# EAGLE design 7segement4digits1badidea-many-digits-mk-2.1 (EAGLE 6.5.0)
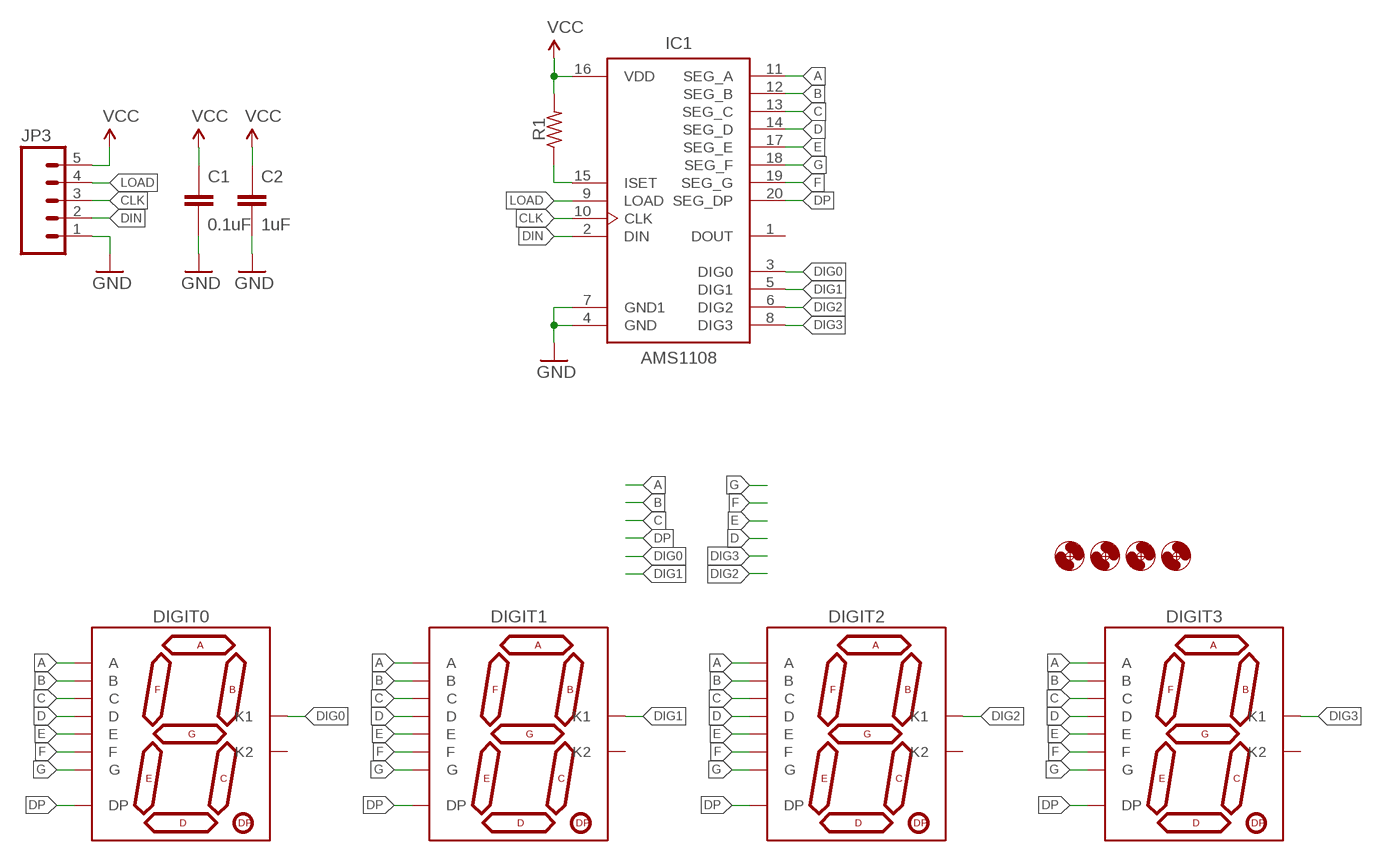
[diagram p0: schematic, sheet 1]

## Parts
C1  0.1uF  CAPACITOR-CERAMICC0603  [C0603]
C2  1uF  CAPACITOR-CERAMICC0805  [C0805]
DIGIT0  7SEG_1DIGPTH-25.4MM  [7SEG_1DIG_25.4MM]
DIGIT1  7SEG_1DIGPTH-25.4MM  [7SEG_1DIG_25.4MM]
DIGIT2  7SEG_1DIGPTH-25.4MM  [7SEG_1DIG_25.4MM]
DIGIT3  7SEG_1DIGPTH-25.4MM  [7SEG_1DIG_25.4MM]
H1  HOLE#2  [HOLE-#2]
H2  HOLE#2  [HOLE-#2]
H3  HOLE#2  [HOLE-#2]
H4  HOLE#2  [HOLE-#2]
IC1  AMS1108  AMS1108SOIC-20W  [SO20W-NOSUCK]
JP3  M05PTH  [1X05]
R1  RESISTORR0603  [R0603]

## Nets
A: DIGIT0.7(A) DIGIT1.7(A) DIGIT2.7(A) DIGIT3.7(A) IC1.11(SEG_A)
B: DIGIT0.6(B) DIGIT1.6(B) DIGIT2.6(B) DIGIT3.6(B) IC1.12(SEG_B)
C: DIGIT0.4(C) DIGIT1.4(C) DIGIT2.4(C) DIGIT3.4(C) IC1.13(SEG_C)
CLK: IC1.10(CLK) JP3.3
D: DIGIT0.2(D) DIGIT1.2(D) DIGIT2.2(D) DIGIT3.2(D) IC1.14(SEG_D)
DIG0: DIGIT0.3(K1) IC1.3(DIG0)
DIG1: DIGIT1.3(K1) IC1.5(DIG1)
DIG2: DIGIT2.3(K1) IC1.6(DIG2)
DIG3: DIGIT3.3(K1) IC1.8(DIG3)
DIN: IC1.2(DIN) JP3.2
DP: DIGIT0.5(DP) DIGIT1.5(DP) DIGIT2.5(DP) DIGIT3.5(DP) IC1.20(SEG_DP)
E: DIGIT0.1(E) DIGIT1.1(E) DIGIT2.1(E) DIGIT3.1(E) IC1.17(SEG_E)
F: DIGIT0.9(F) DIGIT1.9(F) DIGIT2.9(F) DIGIT3.9(F) IC1.19(SEG_G)
G: DIGIT0.10(G) DIGIT1.10(G) DIGIT2.10(G) DIGIT3.10(G) IC1.18(SEG_F)
GND: C1.2 C2.2 IC1.4(GND) IC1.7(GND1) JP3.1
LOAD: IC1.9(LOAD) JP3.4
N$1: IC1.15(ISET) R1.1
VCC: C1.1 C2.1 IC1.16(VDD) JP3.5 R1.2
Unconnected: DIGIT0.8(K2) DIGIT1.8(K2) DIGIT2.8(K2) DIGIT3.8(K2) IC1.1(DOUT)

## Library data of the parts
C1 C2 = A_butts:CAPACITOR-CERAMIC: CAPACITOR, European symbol
DIGIT0 DIGIT1-DIGIT3 = A_butts:7SEG_1DIG
H1-H4 = A_butts:HOLE: MOUNTING HOLE with drill center marker
IC1 = A_butts:AMS1108
JP3 = A_butts:M05: Header 5 Standard 5-pin 0.1" header. Use with straight break away headers (SKU : PRT-00116), right angle break away headers (PRT-00553), swiss pins (PRT-00743), machine pins (PRT-00117), and female headers (PRT-00115). Molex polarized connector foot print use with SKU : PRT-08230 with associated crimp pins and housings.
R1 = A_butts:RESISTOR: RESISTOR, American symbol

## Board
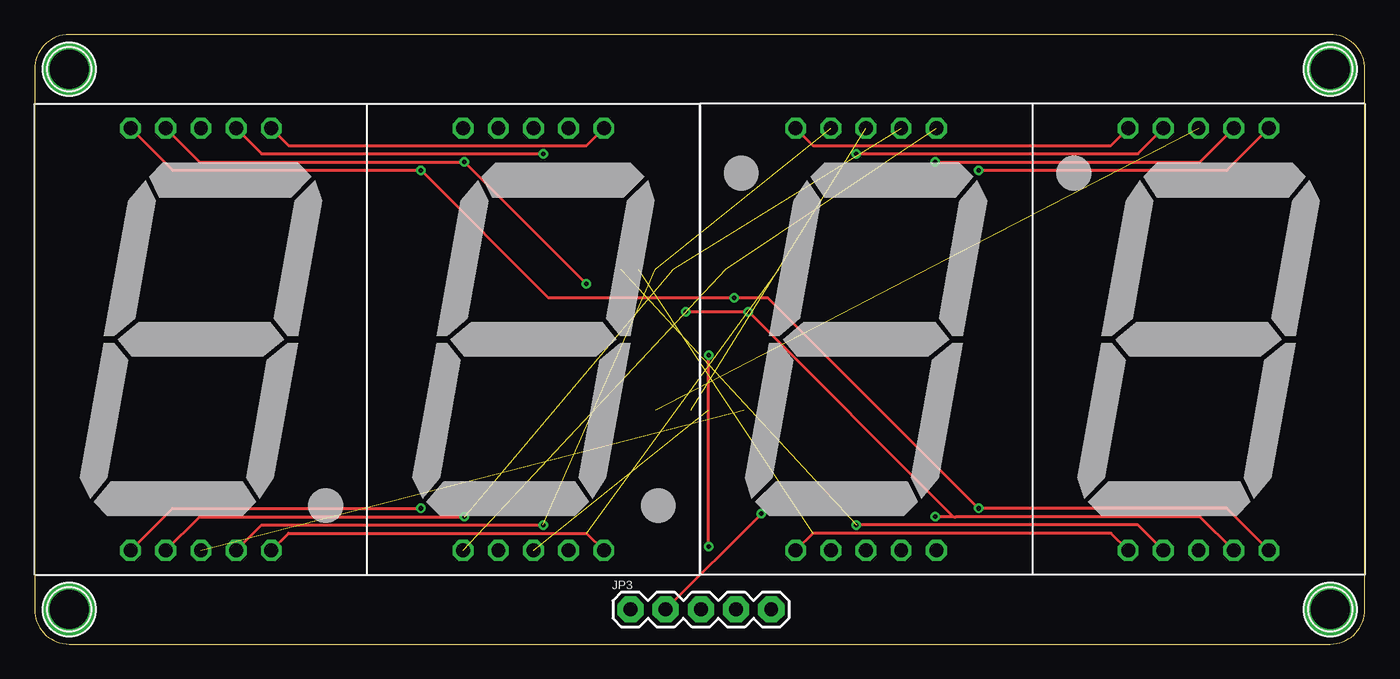
[diagram p1: board, top side]
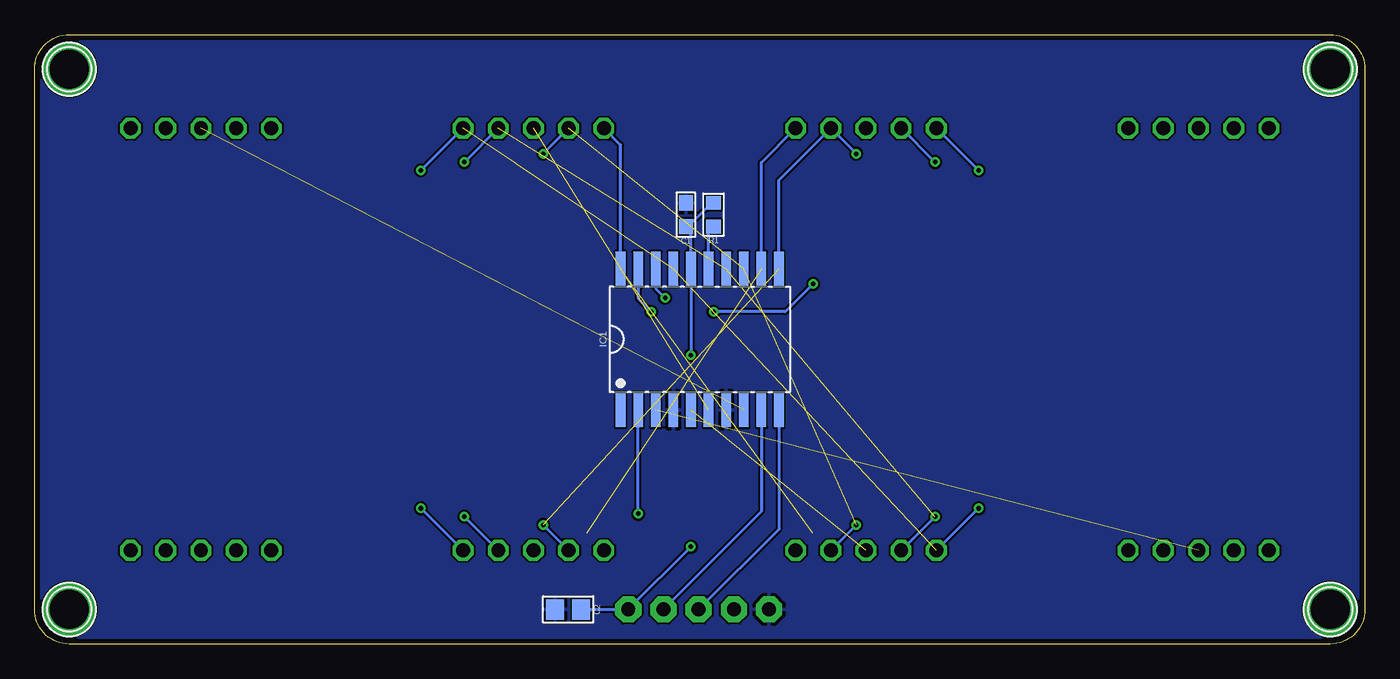
[diagram p2: board, bottom side, seen from below]

Size 96 x 44 mm. Coordinates in mm from the lower left corner, seen from the top.
Outline: 2.5,0 93.5,0 arc90 96,2.5 96,41.5 arc90 93.5,44 2.5,44 arc90 0,41.5 0,2.5 arc90 2.5,0
Copper layers (1*16): Top 0.0356mm / dielectric 1.5011mm / Bottom 0.0356mm
Design rules "LaenPCBOrder_2": minimum track width 6mil, minimum drill 13mil, track to track 6mil, track to pad 6mil, pad to pad 6mil, via to via 6mil, smd to smd 6mil, copper to edge 15mil, drill to drill 6mil, minimum pad ring 7mil, minimum via ring 7mil, stop-mask expansion 3mil, vias tented up to drill 20mil, thermal gap 10mil

### Footprints (pad centres in the part's own frame; a part is rotated, then mirrored left to right if it is on the bottom)
C0603 = smd 1.1 x 1: 1 -0.85,0; 2 0.85,0
C0805 = smd 1.3 x 1.5: 1 -0.95,0; 2 0.95,0
7SEG_1DIG_25.4MM = drill 1 pad 1.5 octagon: 1 -5.08,-15.24; 2 -2.54,-15.24; 3 0,-15.24; 4 2.54,-15.24; 5 5.08,-15.24; 6 5.08,15.24; 7 2.54,15.24; 8 0,15.24; 9 -2.54,15.24; 10 -5.08,15.24
HOLE-#2 = drill 2.8 pad 3.81: P$1 0,0
SO20W-NOSUCK = smd 0.7 x 2.5: 1 -5.715,-5.08; 2 -4.445,-5.08; 3 -3.175,-5.08; 4 -1.905,-5.08; 5 -0.635,-5.08; 6 0.635,-5.08; 7 1.905,-5.08; 8 3.175,-5.08; 9 4.445,-5.08; 10 5.715,-5.08; 11 5.715,5.08; 12 4.445,5.08; 13 3.175,5.08; 14 1.905,5.08; 15 0.635,5.08; 16 -0.635,5.08; 17 -1.905,5.08; 18 -3.175,5.08; 19 -4.445,5.08; 20 -5.715,5.08
1X05 = drill 1 pad 1.88 octagon: 1 0,0; 2 2.54,0; 3 5.08,0; 4 7.62,0; 5 10.16,0
R0603 = smd 1 x 1.1: 1 -0.85,0; 2 0.85,0

### Placement (x,y rotation side)
C1  49,31 90 bottom
C2  57.5,2.5 180 bottom
DIGIT0  12,22 0 top
DIGIT1  36,22 0 top
DIGIT2  60,22 180 top
DIGIT3  84,22 180 top
H1  2.5,2.5 0 top
H2  2.5,41.5 0 top
H3  93.5,41.5 0 top
H4  93.5,2.5 0 top
IC1  48,22 0 bottom
JP3  43,2.5 0 top
R1  47,31 90 bottom

### Tracks (layer width: path | path; a pad name or v marks a point on that pad's centre or on a via)
A  (via drill 0.33)  (1 unrouted)
  Top 0.2: DIGIT0.7 16.38,35.4 v36.7,35.4 | DIGIT3.7 79.62,8.6 v59.3,8.6
  Bottom 0.2: v36.7,35.4 DIGIT1.7 42.28,33.49 IC1.11 | v59.3,8.6 DIGIT2.7
B  (1 unrouted)
  Top 0.2: DIGIT0.6 18.32,36 39.84,36 DIGIT1.6 | DIGIT3.6 77.68,8 56.16,8 DIGIT2.6
  Bottom 0.2: IC1.12 43.55,34.77 DIGIT1.6
C  (via drill 0.33)  (2 unrouted)
  Top 0.2: DIGIT0.4 16.38,8.6 v36.7,8.6 | v59.3,35.4 79.62,35.4 DIGIT3.4
  Bottom 0.2: v36.7,8.6 DIGIT1.4 | DIGIT2.4 v59.3,35.4
CLK
  Bottom 0.2: IC1.10 42.28,8.29 JP3.3
D  (via drill 0.33)  (2 unrouted)
  Top 0.2: DIGIT0.2 11.9,9.2 v31.02,9.2 | v64.98,34.8 84.1,34.8 DIGIT3.2
  Bottom 0.2: v31.02,9.2 DIGIT1.2 | DIGIT2.2 v64.98,34.8
DIG0  (1 unrouted)
DIG1  (1 unrouted)
DIG2  (1 unrouted)
DIG3  (1 unrouted)
DIN  (via drill 0.33)
  Top 0.2: JP3.2 v52.45,9.4
  Bottom 0.2: v52.45,9.4 IC1.2
DP  (1 unrouted)
  Top 0.2: DIGIT0.5 18.32,8 39.84,8 DIGIT1.5 | DIGIT3.5 77.68,36 56.16,36 DIGIT2.5
  Bottom 0.2: IC1.20 53.72,36.03 DIGIT2.5
E  (via drill 0.33)  (2 unrouted)
  Top 0.2: DIGIT0.1 9.96,9.8 v27.88,9.8 | v68.12,34.2 86.04,34.2 DIGIT3.1
  Bottom 0.2: v27.88,9.8 DIGIT1.1 | DIGIT2.1 v68.12,34.2
F  (via drill 0.33)
  Top 0.2: DIGIT0.9 11.9,34.8 v31.02,34.8 v39.82,26 | DIGIT3.9 84.1,9.2 66.5,9.2 66.3,9.2 | 66.3,9.2 v64.98,9.2 | v47,24 v51.5,24 66.3,9.2
  Bottom 0.2: v64.98,9.2 DIGIT2.9 | v31.02,34.8 DIGIT1.9 | IC1.19 52.45,24.95 v51.5,24 | v39.82,26 41.82,24 v47,24
G  (via drill 0.33)
  Top 0.2: DIGIT0.10 9.96,34.2 v27.88,34.2 37.08,25 v50.5,25 52.92,25 v68.12,9.8 86.04,9.8 DIGIT3.10
  Bottom 0.2: v68.12,9.8 DIGIT2.10 | v27.88,34.2 DIGIT1.10 | IC1.18 51.17,25.68 v50.5,25
GND
  pour Bottom: 0,0 0,44 96,44 96,0
LOAD
  Bottom 0.2: IC1.9 43.55,9.56 JP3.4
N$1
  Bottom 0.2: IC1.15 47.37,29.79 R1.1
VCC  (via drill 0.33)
  Top 0.2: v48.63,7.03 v48.63,20.86
  Bottom 0.2: C2.1 JP3.5 v48.63,7.03 | v48.63,20.86 IC1.16 48.63,29.79 C1.1 48.85,30.15 47.15,31.85 R1.2